# EAGLE design 外形 (EAGLE 9.6.2)
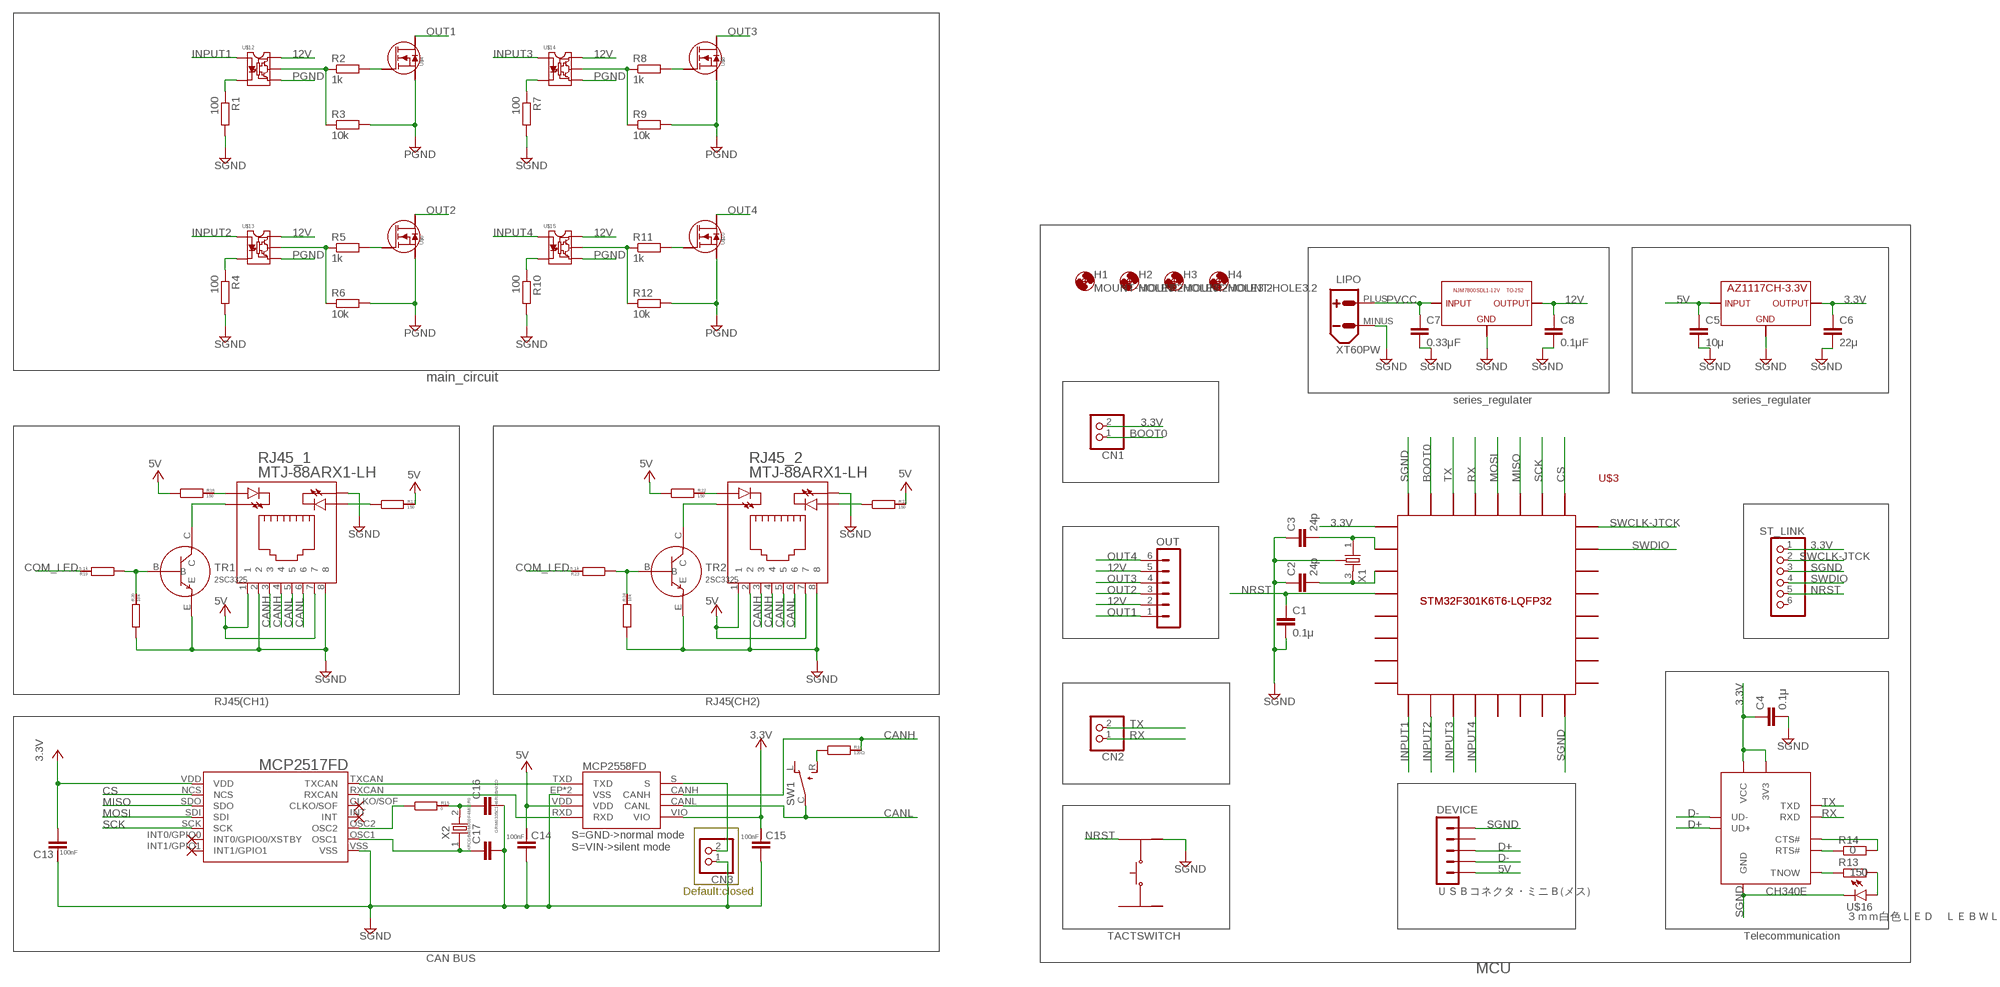
[diagram p0: schematic, sheet 1]

## Parts
C1  0.1μ  GRM0335C1E240GA01D  [GRM0335C1E240GA01D]
C2  24p  GRM0335C1E240GA01D  [GRM0335C1E240GA01D]
C3  24p  GRM0335C1E240GA01D  [GRM0335C1E240GA01D]
C4  0.1μ  GRM0335C1E240GA01D  [GRM0335C1E240GA01D]
C5  10μ  GRM0335C1E240GA01D  [GRM0335C1E240GA01D]
C6  22μ  GRM0335C1E240GA01D  [GRM0335C1E240GA01D]
C7  0.33μF  GRM0335C1E240GA01D  [GRM0335C1E240GA01D]
C8  0.1μF  GRM0335C1E240GA01D  [GRM0335C1E240GA01D]
C13  GCM188L81H104KA57  [GCM188L81H104KA57]
C14  GCM188L81H104KA57  [GCM188L81H104KA57]
C15  GCM188L81H104KA57  [GCM188L81H104KA57]
C16  GRM0335C1H6R0BA01D  [GRM0335C1H120GA01]
C17  GRM0335C1H6R0BA01D  [GRM0335C1H120GA01]
CN1  PINHD-1X2  [1X02]
CN2  PINHD-1X2  [1X02]
CN3  PINHD-1X2  [1X02]
DEVICE  ＵＳＢコネクタ・ミニＢ(メス)  [ＵＳＢコネクタ・ミニＢ(メス)]
H1  MOUNT-HOLE3.2  [3,2]
H2  MOUNT-HOLE3.2  [3,2]
H3  MOUNT-HOLE3.2  [3,2]
H4  MOUNT-HOLE3.2  [3,2]
LIPO  XT60PW  [XT60PW]
OUT  06-JST  [B6B-XH]
R1  100  R-EU_M1206  [M1206]
R2  1k  R-EU_M1206  [M1206]
R3  10k  R-EU_M1206  [M1206]
R4  100  R-EU_M1206  [M1206]
R5  1k  R-EU_M1206  [M1206]
R6  10k  R-EU_M1206  [M1206]
R7  100  R-EU_M1206  [M1206]
R8  1k  R-EU_M1206  [M1206]
R9  10k  R-EU_M1206  [M1206]
R10  100  R-EU_M1206  [M1206]
R11  1k  R-EU_M1206  [M1206]
R12  10k  R-EU_M1206  [M1206]
R13  150  R-EU_M1206  [M1206]
R14  0  R-EU_M1206  [M1206]
R15  0  CR0603  [CR0603]
R16  120Ω  CR0603  [CR0603]
R17  150  CR0603  [CR0603]
R18  150  CR0603  [CR0603]
R19  5.1k  CR0603  [CR0603]
R20  10k  CR0603  [CR0603]
R21  150  CR0603  [CR0603]
R22  150  CR0603  [CR0603]
R23  5.1k  CR0603  [CR0603]
R24  10k  CR0603  [CR0603]
REGYURETA  ３．３V  ＡＺ１１１７ＣＨ－３．３ＴＲＧ１  [ＡＺ１１１７ＣＨ－３．３ＴＲＧ１]
RJ45_1  MTJ-88ARX1-LH  [MTJ-88ARX1-LH]
RJ45_2  MTJ-88ARX1-LH  [MTJ-88ARX1-LH]
ST_LINK  PINHD-1X6  [1X06]
SW1  SS-12SDP2  [SS-12SDP2]
TR1  2SC3325  [2SC3325]
TR2  2SC3325  [2SC3325]
U1  CH340E  [MSOP-10]
U2  MCP2517FD  [MCP2517FD]
U$1  MCP2558FD  [MCP2558FD]
U$3  STM32K6T6-LQFP32  [STM32F301K6T6-LQFP32]
U$4  PXN012-60QL  [PXN012-60QL]
U$5  TACTSWITCH  [TACTSWITCH]
U$6  PXN012-60QL  [PXN012-60QL]
U$8  PXN012-60QL  [PXN012-60QL]
U$10  PXN012-60QL  [PXN012-60QL]
U$12  TLP155E  [TLP155E]
U$13  TLP155E  [TLP155E]
U$14  TLP155E  [TLP155E]
U$15  TLP155E  [TLP155E]
U$16  ３ｍｍ白色ＬＥＤ ＬＥＢＷＬ３４Ａ０６ＡＡ００  [LED5MM]
U$17  NJM7800SDL1-12V  [NJM7800SDL1-12V]
X1  RH100-24.000-18-1020-EXT-TR  [RH100-24.000-18-1020-EXT-TR]
X2  XRCGB40M000F4M01R0  [XRCGB40M000F4M00R0]

## Nets
3.3V: C4.1 C6.1 C13.P$2 C15.P$1 CN1.2 REGYURETA.OUTPUT REGYURETA.VOUT(OUTPUT) ST_LINK.1 U1.3V3 U1.VCC U2.VDD U$1.VIO U$3.VDD1 ; supply symbol labelled +3V3
5V: C5.1 C14.P$1 DEVICE.VBUS R17.RIGHT R18.LEFT R21.RIGHT R22.LEFT REGYURETA.INPUT RJ45_1.1 RJ45_1.7 RJ45_2.1 RJ45_2.7 U$1.VDD ; supply symbol labelled +5V
12V: C8.1 OUT.2 OUT.5 U$12.VCC U$13.VCC U$14.VCC U$15.VCC U$17.VOUT(OUTPUT)
BOOT0: CN1.1 U$3.BOOT0
CANH: R16.RIGHT RJ45_1.3 RJ45_1.4 RJ45_2.3 RJ45_2.4 U$1.CANH
CANL: RJ45_1.5 RJ45_1.6 RJ45_2.5 RJ45_2.6 SW1.C U$1.CANL
COM_LED: R19.RIGHT R23.RIGHT
CS: U2.NCS U$3.PA15
D+: DEVICE.D+ U1.UD+
D-: DEVICE.D- U1.UD-
INPUT1: U$3.PA3 U$12.ANODE
INPUT2: U$3.PA4 U$13.ANODE
INPUT3: U$3.PA5 U$14.ANODE
INPUT4: U$3.PA6 U$15.ANODE
MISO: U2.SDO U$3.PB4(PB3)
MOSI: U2.SDI U$3.PB5(PB4)
N$1: R2.2 U$4.GATE
N$3: R5.2 U$6.GATE
N$4: R13.2 U$16.A
N$5: R13.1 U1.TNOW
N$6: R1.1 U$12.CATHODE
N$9: R4.1 U$13.CATHODE
N$10: R14.1 U1.RTS#
N$11: R14.2 U1.CTS#
N$12: C2.2 U$3.PF1/OSC_OUT X1.3
N$14: R7.1 U$14.CATHODE
N$15: R8.2 U$8.GATE
N$16: R11.2 U$10.GATE
N$19: R10.1 U$15.CATHODE
N$20: C3.2 U$3.PF0/OSC_IN X1.1
N$23: R16.LEFT SW1.R
N$27: U2.TXCAN U$1.TXD
N$28: U2.RXCAN U$1.RXD
N$38: R15.LEFT U2.OSC2
N$39: C17.1 U2.OSC1 X2.1
N$42: C16.1 R15.RIGHT X2.2
N$51: R17.LEFT RJ45_1.LED2_A
N$53: R21.LEFT RJ45_2.LED2_A
N$68: CN3.2 U$1.S
N$69: R18.RIGHT RJ45_1.LED1_A
N$70: R22.RIGHT RJ45_2.LED1_A
N$71: RJ45_1.LED1_K TR1.C
N$72: RJ45_2.LED1_K TR2.C
N$73: R23.LEFT R24.RIGHT TR2.B
N$74: R19.LEFT R20.RIGHT TR1.B
NRST: C1.1 ST_LINK.5 U$3.NRST U$5.P$1
OUT1: OUT.1 U$4.DRAIN1(DRAIN) U$4.DRAIN2(DRAIN) U$4.DRAIN3(DRAIN) U$4.DRAIN4(DRAIN)
OUT2: OUT.3 U$6.DRAIN1(DRAIN) U$6.DRAIN2(DRAIN) U$6.DRAIN3(DRAIN) U$6.DRAIN4(DRAIN)
OUT3: OUT.4 U$8.DRAIN1(DRAIN) U$8.DRAIN2(DRAIN) U$8.DRAIN3(DRAIN) U$8.DRAIN4(DRAIN)
OUT4: OUT.6 U$10.DRAIN1(DRAIN) U$10.DRAIN2(DRAIN) U$10.DRAIN3(DRAIN) U$10.DRAIN4(DRAIN)
PGND: R3.2 R6.2 R9.2 R12.2 U$4.SOURCE1(SOURCE) U$4.SOURCE2(SOURCE) U$4.SOURCE3(SOURCE) U$6.SOURCE1(SOURCE) U$6.SOURCE2(SOURCE) U$6.SOURCE3(SOURCE) U$8.SOURCE1(SOURCE) U$8.SOURCE2(SOURCE) U$8.SOURCE3(SOURCE) U$10.SOURCE1(SOURCE) U$10.SOURCE2(SOURCE) U$10.SOURCE3(SOURCE) U$12.GND U$13.GND U$14.GND U$15.GND ; supply symbol labelled GND
PVCC: C7.1 LIPO.PLUS(+) U$17.VIN(INPUT)
RX: CN2.1 U1.RXD U$3.PB6(PB5)
SCK: U2.SCK U$3.PB3(PB2)
SGND: C1.2 C2.1 C3.1 C4.2 C5.2 C6.2 C7.2 C8.2 C13.P$1 C14.P$2 C15.P$2 C16.2 C17.2 CN3.1 DEVICE.GND LIPO.MINUS(-) R1.2 R4.2 R7.2 R10.2 R20.LEFT R24.LEFT REGYURETA.ADJ/GND(GND) RJ45_1.2 RJ45_1.8 RJ45_1.LED2_K RJ45_2.2 RJ45_2.8 RJ45_2.LED2_K ST_LINK.3 TR1.E TR2.E U1.GND U2.VSS U$1.EP(VSS) U$1.VSS U$3.VSS1 U$3.VSS2 U$5.P$3 U$16.K(C) U$17.GND X1.2(SHIELD) X1.4(SHIELD) ; supply symbol labelled GND
SWCLK-JTCK: ST_LINK.2 U$3.PA14
SWDIO: ST_LINK.4 U$3.PA13
TX: CN2.2 U1.TXD U$3.PB7(PB6)
V1: R2.1 R3.1 U$12.VOUT
V2: R5.1 R6.1 U$13.VOUT
V3: R8.1 R9.1 U$14.VOUT
V4: R11.1 R12.1 U$15.VOUT
Unconnected: DEVICE.ID ST_LINK.6 SW1.L U2.CLKO/SOF U2.INT U2.INT0/GPIO0(INT0/GPIO0/XSTBY) U2.INT1/GPIO1 U$3.PA0 U$3.PA1 U$3.PA2 U$3.PA7 U$3.PA8 U$3.PA9 U$3.PA10 U$3.PA11 U$3.PA12 U$3.PB0 U$3.PB1 U$3.VDD2 U$3.VDDA/VREF+ U$5.P$2 U$5.P$4

## Notes on the sheet
- main_circuit
- series_regulater | series_regulater
- RJ45(CH1) | RJ45(CH2)
- S=GND->normal mode
  S=VIN->silent mode
- Default:closed
- TACTSWITCH | Telecommunication
- CAN BUS
- MCU

## Library data of the parts
C1-C8 = GRM0335C1E240GA01D:GRM0335C1E240GA01D
C13-C15 = GCM188L81H104K57(0.1uF):GCM188L81H104KA57
C16 C17 = GRM0335C1H6R0BA01D:GRM0335C1H6R0BA01D
CN1-CN3 = pinhead:PINHD-1X2: PIN HEADER
DEVICE = ＵＳＢコネクタ・ミニＢ(メス):ＵＳＢコネクタ・ミニＢ(メス)
H1-H4 = holes:MOUNT-HOLE: MOUNTING HOLE with drill center marker
LIPO = xt60pw:XT60PW
OUT = con-jst-xh (1):06-JST: JST CONNECTOR
R1-R14 = rcl:R-EU_: RESISTOR, European symbol; SPICEPREFIX: R
R15-R24 = CR0603:CR0603
REGYURETA = AZ1117CH-3.3TRG1:ＡＺ１１１７ＣＨ－３．３ＴＲＧ１
RJ45_1 RJ45_2 = MTJ-88ARX1-LH:MTJ-88ARX1-LH
ST_LINK = pinhead:PINHD-1X6: PIN HEADER
SW1 = SS-12SDP2:SS-12SDP2
TR1 TR2 = 2SC3325:2SC3325
U1 = CH340E:CH340E
U2 = MCP2517FD:MCP2517FD
U$1 = MCP2558FD:MCP2558FD
U$3 = STM32F301K6T6-LQFP32:STM32K6T6-LQFP32
U$4 U$6 U$8 U$10 = mosfet PXN012-60QL:PXN012-60QL
U$5 = TACTSWITCH (CS11027.0F100):TACTSWITCH
U$12-U$15 = TLP155E(TPL, E)):TLP155E
U$16 = LED３ｍｍ白色　ＬＥＢＷＬ３４Ａ０６ＡＡ００:３ｍｍ白色ＬＥＤ　ＬＥＢＷＬ３４Ａ０６ＡＡ００
U$17 = TO-250 NJM7800SDL1-12V:NJM7800SDL1-12V
X1 = RH100-24.000-18-1020-EXT-TR:RH100-24.000-18-1020-EXT-TR
X2 = XRCGB40M000F4M01R0:XRCGB40M000F4M01R0

## Board
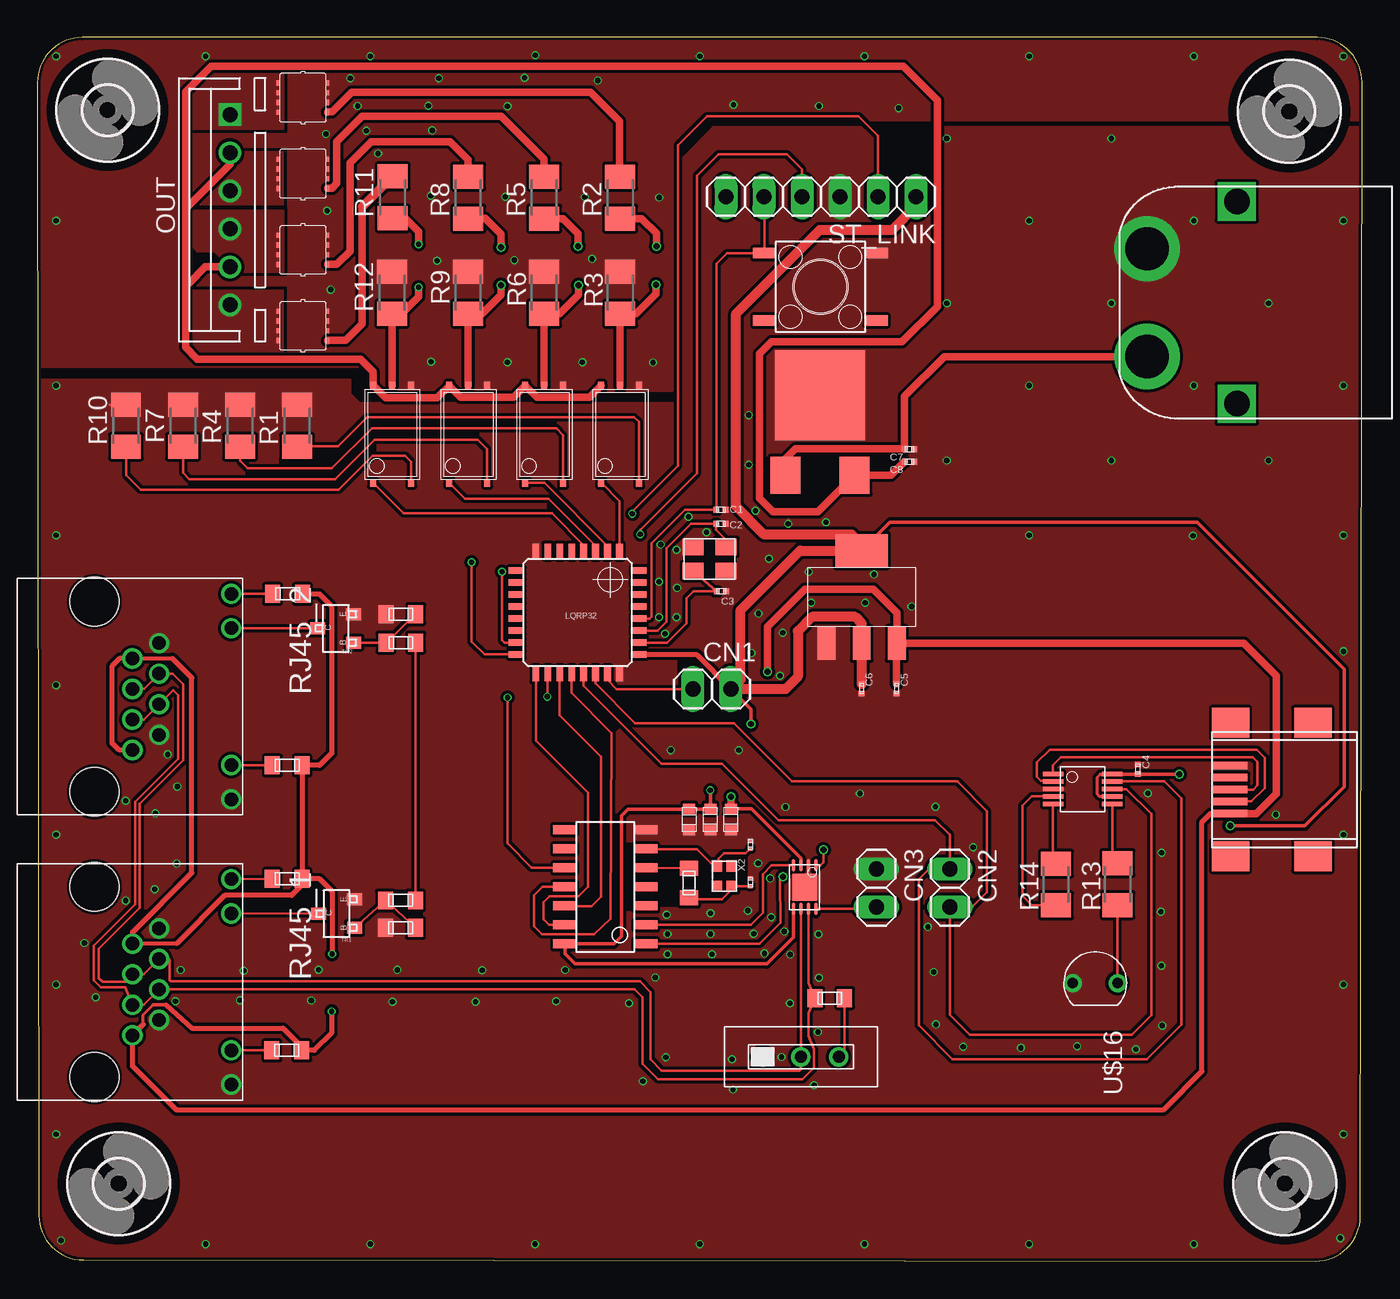
[diagram p1: board, top side]
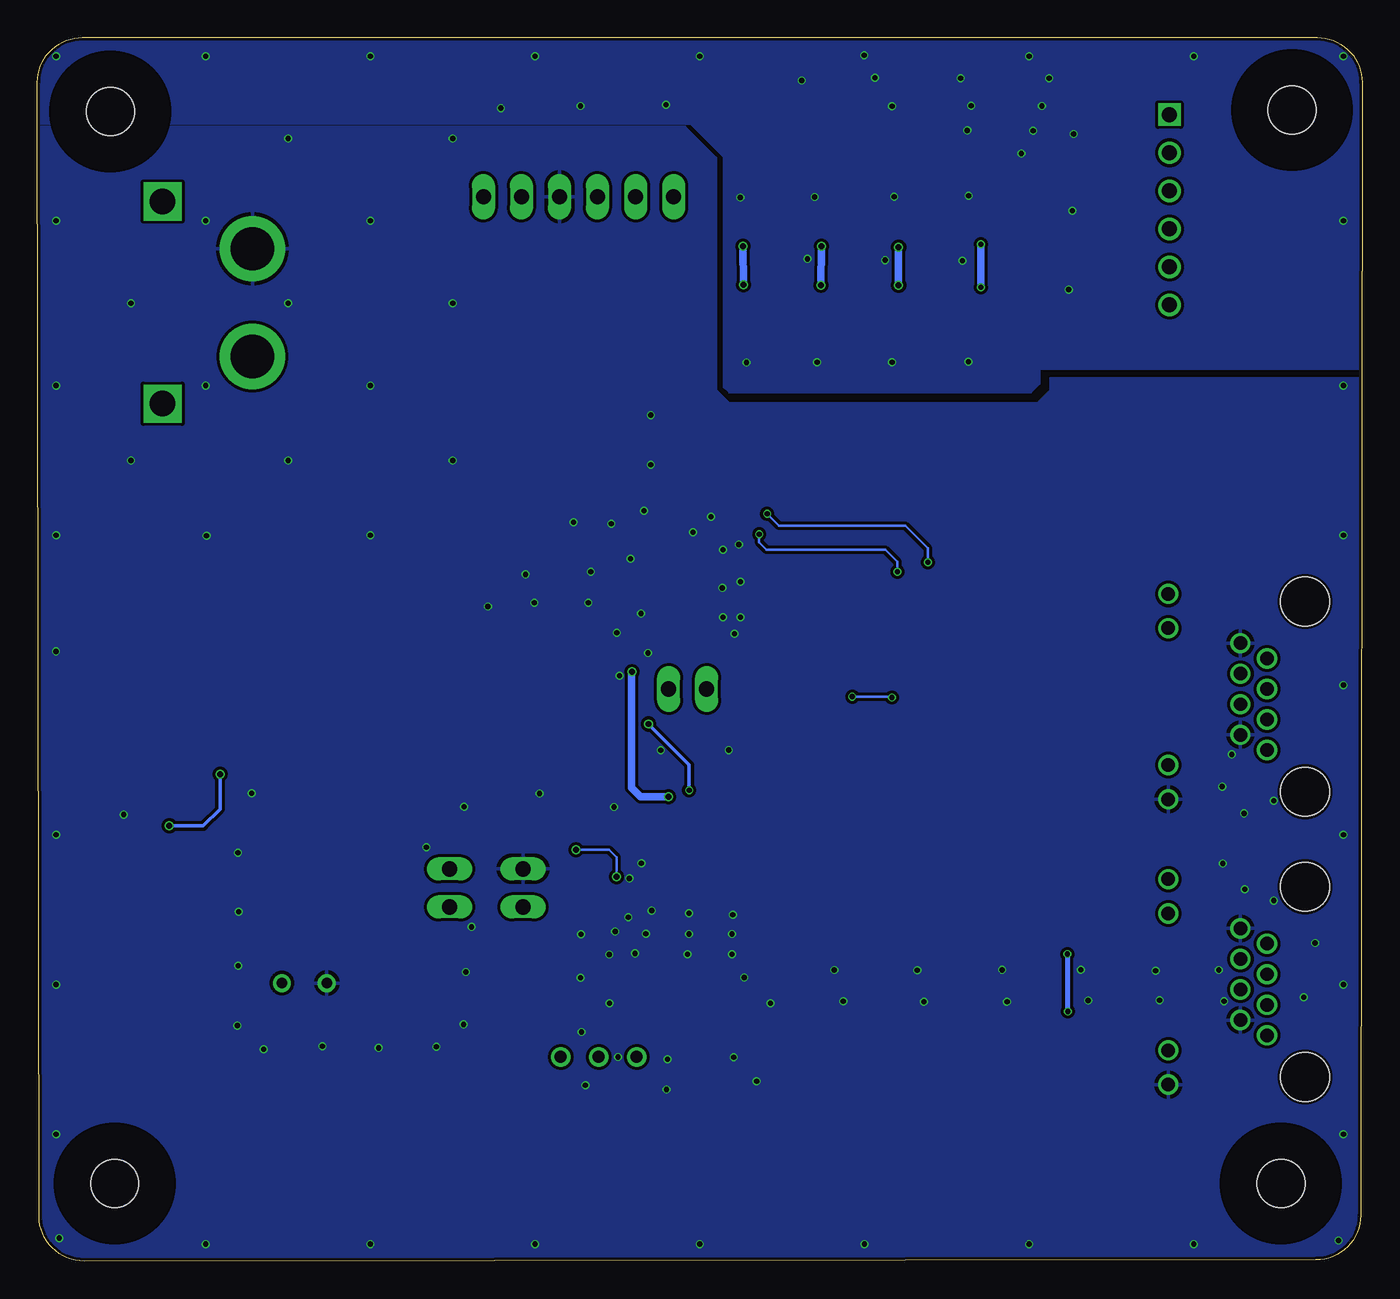
[diagram p2: board, bottom side, seen from below]

Size 88.49 x 81.72 mm. Coordinates in mm from the lower left corner, seen from the top.
Outline: 0,78.71 0.09,3.07 arc90 3.09,0.07 85.38,0 arc90 88.38,3 88.49,78.71 arc90 85.49,81.72 3,81.72 arc90 0,78.71
Copper layers (1*16): Top 0.035559375mm / dielectric 1.6mm / Bottom 0.035559375mm
Design rules "jlcpcb2layer *": minimum track width 5mil, minimum drill 12mil, track to track 8mil, track to pad 8mil, pad to pad 5mil, via to via 5mil, smd to smd 5mil, copper to edge 8mil, drill to drill 6mil, minimum pad ring 5mil, minimum via ring 3mil, stop-mask expansion 2.5mil, vias tented up to drill 0mil, thermal gap 10mil

### Footprints (pad centres in the part's own frame; a part is rotated, then mirrored left to right if it is on the bottom)
GRM0335C1E240GA01D = smd 0.35 x 0.4: 1 -0.325,0; 2 0.325,0
GCM188L81H104KA57 = smd 0.7 x 0.8: P$1 -0.7,0; P$2 0.7,0
GRM0335C1H120GA01 = smd 0.25 x 0.3: 1 -0.275,0; 2 0.275,0
1X02 = drill 1.016 long: 1 -1.27,0; 2 1.27,0
ＵＳＢコネクタ・ミニＢ(メス) = smd 0.5 x 2.3: D+ 0,2.77; D- -0.8,2.77; GND 1.6,2.77; ID 0.8,2.77; VBUS -1.6,2.77 | smd 2 x 2.5: P$6 -4.45,2.75; P$7 -4.45,-2.75; P$8 4.45,2.75; P$9 4.45,-2.75
3,2 = hole 3.2: 0,0
XT60PW = drill 2.9 pad 4.35: MINUS -3.6,0; PLUS 3.6,0 | drill 1.7 square: P$1 -6.75,6; P$2 6.75,6
B6B-XH = drill 1 square: 1 6.35,0 | drill 1: 2 3.81,0; 3 1.27,0; 4 -1.27,0; 5 -3.81,0; 6 -6.35,0
M1206 = smd 1.6 x 2: 1 -1.4,0; 2 1.4,0
CR0603 = smd 1 x 1.2: LEFT -1,0; RIGHT 1,0
ＡＺ１１１７ＣＨ－３．３ＴＲＧ１ = smd 1.2 x 2.2: ADJ/GND -2.35,-3.1; INPUT 2.35,-3.1; OUTPUT 0,-3.1 | smd 3.5 x 2.2: VOUT 0,3.1
MTJ-88ARX1-LH = drill 0.9: 1 9.92,2.54; 2 8.9,4.32; 3 7.88,2.54; 4 6.86,4.32; 5 5.84,2.54; 6 4.82,4.32; 7 3.8,2.54; 8 2.78,4.32; LED1_A -0.51,9.14; LED1_K 1.78,9.14; LED2_A 10.92,9.14; LED2_K 13.21,9.14 | hole 3.25: 0,0; 12.7,0
1X06 = drill 1.016 long: 1 -6.35,0; 2 -3.81,0; 3 -1.27,0; 4 1.27,0; 5 3.81,0; 6 6.35,0
SS-12SDP2 = drill 0.8 pad 1.3: C 0,0; L -2.54,0; R 2.54,0
2SC3325 = smd 1 x 0.8: B 0,1.9; C 2.4,0.95; E 0,0
MSOP-10 = smd 0.3 x 1.35: 3V3 -1,1.975; CTS# 1,-1.975; GND 0,-1.975; RTS# 0.5,-1.975; RXD -0.5,1.975; TNOW 1,1.975; TXD 0,1.975; UD+ -1,-1.975; UD- -0.5,-1.975; VCC 0.5,1.975
MCP2517FD = smd 0.6 x 1.55: CLKO/SOF 2.54,0; INT 3.81,0; INT0/GPIO0 6.35,5.4; INT1/GPIO1 7.62,5.4; NCS 1.27,5.4; OSC1 6.35,0; OSC2 5.08,0; RXCAN 1.27,0; SCK 5.08,5.4; SDI 3.81,5.4; SDO 2.54,5.4; TXCAN 0,0; VDD 0,5.4; VSS 7.62,0
MCP2558FD = smd 0.25 x 0.85: CANH -0.25,1.45; CANL 0.25,1.45; RXD 0.75,-1.45; S -0.75,1.45; TXD -0.75,-1.45; VDD 0.25,-1.45; VIO 0.75,1.45; VSS -0.25,-1.45 | smd 1.65 x 1.8: EP 0,0
STM32F301K6T6-LQFP32 = smd 0.45 x 1: BOOT0 -2,4.1; PA3 -2.8,-4.1; PA4 -2,-4.1; PA5 -1.2,-4.1; PA6 -0.4,-4.1; PA7 0.4,-4.1; PA15 2.8,4.1; PB0 1.2,-4.1; PB1 2,-4.1; PB3 2,4.1; PB4 1.2,4.1; PB5 0.4,4.1; PB6 -0.4,4.1; PB7 -1.2,4.1; VSS1 2.8,-4.1; VSS2 -2.8,4.1 | smd 1 x 0.45: NRST -4.1,0.4; PA0 -4.1,-1.2; PA1 -4.1,-2; PA2 -4.1,-2.8; PA8 4.1,-2; PA9 4.1,-1.2; PA10 4.1,-0.4; PA11 4.1,0.4; PA12 4.1,1.2; PA13 4.1,2; PA14 4.1,2.8; PF0/OSC_IN -4.1,2; PF1/OSC_OUT -4.1,1.2; VDD1 -4.1,2.8; VDD2 4.1,-2.8; VDDA/VREF+ -4.1,-0.4
PXN012-60QL = smd 0.35 x 0.2: DRAIN1 -0.975,-1.65; DRAIN2 -0.325,-1.65; DRAIN3 0.325,-1.65; DRAIN4 0.975,-1.65; GATE 0.975,1.65; SOURCE1 -0.975,1.65; SOURCE2 -0.325,1.65; SOURCE3 0.325,1.65
TACTSWITCH = smd 1.5 x 0.7: P$1 -3.75,2.25; P$2 -3.75,-2.25; P$3 3.75,2.25; P$4 3.75,-2.25
TLP155E = smd 0.4 x 0.5: ANODE -1.27,0; CATHODE 1.27,0; GND 1.27,6.5; VCC -1.27,6.5; VOUT 0,6.5
LED5MM = drill 0.7 pad 1.2: A 0,1.5; K 0,-1.5
NJM7800SDL1-12V = smd 6 x 6: GND 0,3 | smd 2 x 2.5: VIN -2.3,-2.35; VOUT 2.3,-2.35
RH100-24.000-18-1020-EXT-TR = smd 1.4 x 1.1: 1 -1.1,-0.8; 2 1.1,-0.8; 3 1.1,0.8; 4 -1.1,0.8
XRCGB40M000F4M00R0 = smd 0.75 x 0.7: 1 -0.675,-0.5; 2 0.675,0.5; NC1 -0.675,0.5; NC2 0.675,-0.5

### Placement (x,y rotation side)
C1  45.67,50.17 0 top
C2  45.67,49.23 180 top
C3  45.69,44.73 180 top
C4  73.5,32.85 90 top
C5  57.4,38.23 270 top
C6  55.06,38.23 270 top
C7  58.25,54.22 0 top
C8  58.25,53.38 0 top
C13  43.53,29.49 90 top
C14  46.33,29.49 270 top
C15  44.95,29.49 270 top
C16  47.62,25.3 90 top
C17  47.62,27.82 90 top
CN1  45.06,38.21 0 top
CN2  60.96,24.92 270 top
CN3  56.05,24.92 270 top
DEVICE  82.46,31.5 90 top
H1  4.69,76.87 0 top
H2  83.63,76.78 0 top
H3  83.33,5.18 0 top
H4  5.43,5.18 0 top
LIPO  74.13,64.01 270 top
OUT  12.86,70.21 90 top
R1  17.34,55.78 90 top
R2  38.93,71.02 90 top
R3  38.93,64.67 90 top
R4  13.53,55.78 90 top
R5  33.85,71.02 90 top
R6  33.85,64.67 90 top
R7  9.72,55.78 90 top
R8  28.77,71.02 90 top
R9  28.77,64.67 90 top
R10  5.91,55.78 90 top
R11  23.73,71.04 90 top
R12  23.69,64.67 90 top
R13  72.16,25.18 270 top
R14  68.04,25.15 90 top
R15  43.53,25.25 270 top
R16  52.93,17.57 180 top
R17  16.66,14.08 0 top
R18  16.68,25.53 180 top
R19  24.25,24.08 0 top
R20  24.25,22.25 0 top
R21  16.68,33.1 0 top
R22  16.71,44.56 180 top
R23  24.28,41.3 0 top
R24  24.28,43.21 0 top
REGYURETA  55.06,44.35 0 top
RJ45_1  3.81,25 270 top
RJ45_2  3.81,44.05 270 top
ST_LINK  52.35,71.07 180 top
SW1  51,13.64 0 top
TR1  21.18,24.16 180 top
TR2  21.13,43.21 180 top
U1  69.82,31.53 270 top
U2  40.64,21.19 90 top
U$1  51.25,24.97 180 top
U$3  36.09,43.31 180 top
U$4  17.74,77.69 270 top
U$5  52.31,65.06 0 top
U$6  17.74,72.61 270 top
U$8  17.74,67.53 270 top
U$10  17.74,62.45 270 top
U$12  38.93,51.97 0 top
U$13  33.85,51.97 0 top
U$14  28.77,51.97 0 top
U$15  23.69,51.97 0 top
U$16  70.66,18.57 270 top
U$17  52.28,54.83 0 top
X1  44.9,46.89 0 top
X2  45.89,25.71 270 top

### Tracks (layer width: path | path; a pad name or v marks a point on that pad's centre or on a via)
3.3V  (via drill 0.35, 0.4 pad 0.55)
  Top 0.152: U$3.VDD1 40.24,40.46 40.32,40.54 | C15.P$1 44.97,30.19 | U2.VDD | 43.51,30.17 C13.P$2 | 55.06,47.36 REGYURETA.VOUT | CN1.2 46.4,38.13 | U1.3V3 | v44.95,31.45 | v76.29,32.52
  Top 0.2: U1.VCC 70.96,31.03 70.8,31.18 70.8,32.31 71.01,32.51 71.78,32.51 U1.3V3
  Top 0.25: U2.VDD 38.52,21.19 39.03,21.7 39.03,29.73 39.47,30.17 43.51,30.17 44.94,30.17 | U$1.VIO 50.5,21.63 48.72,19.85 35.9,19.85 35.24,20.52 U2.VDD | v76.29,32.52 C4.1 U1.3V3 | v79.67,29.06 84.67,29.06 87.3,31.69 87.3,39.51 77.49,49.33 56.94,49.33 REGYURETA.VOUT | CN1.2 47.67,36.86 v47.67,35.87 | C15.P$1 v44.95,31.45
  Top 0.35: U$3.VDD1 44.02,40.51 CN1.2
  Top 0.675: C6.1 REGYURETA.OUTPUT 55.06,42.59 54.64,43.02 51.75,43.02 50.81,42.08 50.81,39.04 49.97,38.21 CN1.2 46.97,38.85 46.97,43.47 50.95,47.45 54.97,47.45 55.06,47.36 | REGYURETA.VOUT 55.06,47.87 54.41,48.52 48.55,48.52 46.67,50.4 46.67,63.27 52.25,68.85 57.07,68.85 58.7,70.48 ST_LINK.1 | C15.P$1 44.94,30.17
  Bottom 0.152: v47.67,35.87 47.67,35.85
  Bottom 0.25: 47.67,35.85 44.95,33.13 v44.95,31.45 | v79.67,29.06 77.42,29.06 76.29,30.19 v76.29,32.52
5V  (via drill 0.35, 0.4 pad 0.55)
  Top 0.152: U$1.VDD | 46.35,30.21 C14.P$1 | RJ45_1.7 | v19.69,20.51 19.67,20.53
  Top 0.2: 7.74,17.12 7.07,16.45 7.07,15.8
  Top 0.25: 7.74,17.12 8.59,17.12 | U$1.VDD 51,26.91 47.71,30.19 C14.P$1
  Top 0.28: 9.29,21.2 RJ45_1.7 | RJ45_2.7 9.01,40.25
  Top 0.35: R18.LEFT 18.85,25.53 19.67,24.71 19.67,20.53 | R18.LEFT R21.RIGHT 18.85,33.1 19.66,33.91 19.66,43.72 18.82,44.56 R22.LEFT | 7.07,15.8 RJ45_1.1 6.35,13.04 9.29,10.09 75.2,10.09 77.8,12.68 77.8,29.32 78.37,29.9 DEVICE.VBUS | 8.59,17.12 10.33,15.56 16.4,15.56 17.66,14.31 R17.RIGHT 18.5,14.08 19.65,15.23 v19.65,16.67 | RJ45_1.7 6.36,21.97 10.32,25.93 10.32,38.96 9.02,40.26 9.01,40.25 | R18.LEFT 17.68,25.13 16.98,24.43 12.52,24.43 9.29,21.2 | RJ45_2.7 5.5,40.25 4.98,39.72 4.98,34.62 5.47,34.13 RJ45_2.1
  Top 0.5: v46.35,31 46.35,30.21 | v48.76,39.35 48.76,42.36 51.27,44.86 55.85,44.86 57.41,43.3 REGYURETA.INPUT | REGYURETA.INPUT 80.59,41.25 82.75,39.1 82.75,31.21 81.42,29.89 DEVICE.VBUS | REGYURETA.INPUT 57.39,41.23 C5.1
  Bottom 0.152: v48.76,39.35 48.8,39.31 | v19.69,20.51 19.67,20.49 | 19.67,16.73 19.65,16.71 v19.65,16.67
  Bottom 0.35: 19.67,20.49 19.67,16.73
  Bottom 0.5: 48.8,39.31 48.8,31.6 48.2,31 v46.35,31
12V
  Top 0.152: 32.58,58.43 U$13.VCC | 27.52,58.47 U$14.VCC | U$15.VCC
  Top 0.3: U$17.VOUT | U$15.VCC 22.46,58.47 | U$14.VCC 27.5,58.45 | U$13.VCC
  Top 0.5: 9.9,70.28 9.9,65.32 | 9.9,65.32 9.9,61.02 10.68,60.24 21.59,60.24 22.42,59.4 U$15.VCC | 9.9,65.32 10.13,65.32 11.22,66.4 OUT.5 | OUT.2 12.86,73.25 9.9,70.28 | 9.9,70.28 9.9,78.08 11.61,79.78 57.86,79.78 60.11,77.53 60.11,63.74 57.76,61.4 49.04,61.4 48.23,60.58 48.23,50.95 49.14,50.04 52.14,50.04 U$17.VOUT 57.03,52.48 C8.1 | 22.46,58.47 23.27,57.67 26.71,57.67 27.52,58.47 | 27.5,58.45 28.26,57.7 31.81,57.7 U$13.VCC | U$13.VCC 33.38,57.69 36.88,57.69 U$12.VCC
BOOT0
  Top 0.152: U$3.BOOT0 38.08,38.81 38.69,38.2 CN1.1
CANH
  Top 0.152: RJ45_2.3 7.11,36.17 RJ45_2.4 9.07,38.13 9.42,37.78 9.42,33.56 6.52,30.66 6.52,23.82 3.77,21.07 3.77,18.76 4.23,18.29 5.86,18.29 RJ45_1.3 7.11,17.12 RJ45_1.4 39.89,18.14 40.41,17.62 40.41,13.19 41.45,12.15 51.1,12.15 51.89,12.93 51.89,14.15 51.51,15.06 51.51,16.55 R16.RIGHT 51.5,18.59 U$1.CANH
CANL
  Top 0.152: RJ45_2.5 7.13,38.21 8.13,39.2 RJ45_2.6 9.04,39.23 9.75,38.52 9.75,33.46 6.83,30.53 6.83,23.59 4.09,20.85 4.09,18.9 4.35,18.64 6.28,18.64 6.35,18.71 RJ45_1.5 7.11,19.16 RJ45_1.6 8.77,20.18 8.84,20.11 8.84,18.75 8.91,18.67 40.26,18.67 40.97,17.97 40.97,13.47 41.7,12.73 50.91,12.73 51,12.82 SW1.C U$1.CANL
COM_LED
  Top 0.152: R23.RIGHT R19.RIGHT
CS
  Top 0.152: U2.NCS 34.19,22.46 33.83,22.82 33.83,23.97 34.21,24.36 36.14,24.36 36.77,24.99 36.77,31.28 33.32,34.74 33.32,39.19 U$3.PA15
D+
  Top 0.152: DEVICE.D+ 81.21,31.49 81.49,31.77 81.49,33.36 81.19,33.66 68.37,33.66 67.85,33.13 U1.UD+
D-
  Top 0.152: U1.UD- 67.78,32.1 67.04,32.1 66.78,32.35 66.78,33.31 67.63,34.15 81.46,34.15 82,33.62 82,31.59 81.1,30.7 DEVICE.D-
INPUT1
  Top 0.152: U$3.PA3 38.89,50.76 U$12.ANODE
INPUT2
  Top 0.152: U$13.ANODE 33.87,51.97 38.13,47.71 38.13,47.45 U$3.PA4
INPUT3
  Top 0.152: U$3.PA5 37.29,47.78 34.16,50.91 28.57,50.91 U$14.ANODE
INPUT4
  Top 0.152: U$3.PA6 36.56,47.49 36.56,47.75 34.37,49.94 24.45,49.94 U$15.ANODE
MISO
  Top 0.152: U2.SDO 35.26,23.71 37,23.71 37.64,24.34 37.64,33.7 34.89,36.44 U$3.PB4
MOSI
  Top 0.152: U2.SDI 33.74,25 33.17,24.43 33.17,22.37 33.72,21.81 37.2,21.81 38.27,22.88 38.36,35.27 35.69,37.94 U$3.PB5
N$1
  Top 0.5: 38.88,72.48 38.88,76.13 36.96,78.05 20.99,78.05 19.68,76.74 19.42,76.74 U$4.GATE
  Top 0.6: R2.2 38.88,72.48
N$3
  Top 0.5: R5.2 33.85,73.59 30.99,76.46 21.69,76.46 20,74.77 20,71.97 19.68,71.66 19.42,71.66 U$6.GATE
N$4
  Top 0.152: R13.2 U$16.A
N$5
  Top 0.152: R13.1 71.8,26.94 U1.TNOW
N$6
  Top 0.152: U$12.CATHODE 40.18,51.99 40.18,56.04 39.87,56.36 22.03,56.36 20.08,54.41 17.37,54.41 R1.1
N$9
  Top 0.152: U$13.CATHODE 35.12,55.16 34.67,55.61 22.35,55.61 19.67,52.93 14.05,52.93 13.53,53.44 R4.1
N$10
  Top 0.152: U1.RTS# 66.43,31.03 65.8,30.4 65.8,24.38 66.43,23.75 R14.1
N$11
  Top 0.152: R14.2 67.85,26.75 U1.CTS#
N$12
  Top 0.152: X1.3 46,48.17 45.34,48.83 C2.2 43.66,49.23 42.02,47.59 42.02,42.71 41.41,42.1 40.2,42.1 U$3.PF1/OSC_OUT
N$14
  Top 0.152: U$14.CATHODE 30.04,54.2 29.41,54.84 22.52,54.84 19.9,52.22 10.14,52.22 9.72,52.64 R7.1
N$15
  Top 0.5: R8.2 28.77,73.55 27.56,74.77 22.31,74.77 20.88,73.34 20.88,67.44 19.99,66.56 U$8.GATE
N$16
  Top 0.152: U$10.GATE
  Top 0.5: U$10.GATE 19.42,61.5 20.59,61.5 21.7,62.61 21.7,70.41
  Top 0.6: R11.2 21.7,70.41
N$19
  Top 0.152: U$15.CATHODE 24.96,53.37 24.56,53.77 22.4,53.77 20.12,51.5 6.91,51.5 5.91,52.49 R10.1
N$20
  Top 0.152: X1.1 C3.2 43.82,44.73 43.35,44.27 43.35,42.61 42.06,41.31 U$3.PF0/OSC_IN
N$23
  Top 0.152: R16.LEFT 53.93,14.03 SW1.R
N$27  (via drill 0.4 pad 0.55)
  Top 0.152: U$1.TXD 52.29,26.42 52.5,26.63 v52.5,27.46 | v49.81,25.67 49.59,25.45 49.62,22.59 48.24,21.19 U2.TXCAN
  Bottom 0.152: v52.5,27.46 50.31,27.46 49.81,26.96 v49.81,25.67
N$28
  Top 0.152: U2.RXCAN 47.66,22.46 48.45,23.25 48.45,25.85 49.03,26.42 U$1.RXD
N$38
  Top 0.152: R15.LEFT U2.OSC2
N$39
  Top 0.152: U2.OSC1 40.66,27.51 44.07,27.51 45.2,26.38 X2.1 45.5,26.49 45.5,26.87 45.86,27.23 47.31,27.23 C17.1
N$42
  Top 0.152: R15.RIGHT 43.61,24.18 45.72,24.18 46.35,24.81 46.35,24.99 X2.2 C16.1
N$51
  Top 0.152: R17.LEFT RJ45_1.LED2_A | RJ45_1.LED2_A
N$53
  Top 0.152: R21.LEFT RJ45_2.LED2_A
N$68
  Top 0.152: CN3.2 55.93,23.52 U$1.S
N$69
  Top 0.152: R18.RIGHT RJ45_1.LED1_A
N$70
  Top 0.152: RJ45_2.LED1_A R22.RIGHT
N$71
  Top 0.152: RJ45_1.LED1_K TR1.C
N$72
  Top 0.152: RJ45_2.LED1_K TR2.C
N$73
  Top 0.152: TR2.B R23.LEFT R24.RIGHT
N$74
  Top 0.152: TR1.B R19.LEFT R20.RIGHT
NRST
  Top 0.152: U$3.NRST 40.89,42.91 41.02,43.04 41.02,47.95 43.26,50.19 45.32,50.19 C1.1 45.37,50.2 45.37,66.62 46.07,67.31 U$5.P$1 48.56,71.05 ST_LINK.5
OUT1
  pour Top (no thermals): 16.41,79.44 11.59,79.44 10.23,78.08 10.23,75.61 16.41,75.61
OUT2
  pour Top (no thermals): 16.38,74.04 12.03,74.04 10.23,72.23 10.23,70.59 16.4,70.59 16.4,74.02
OUT3
  pour Top (no thermals): 10.3,70.15 10.3,67.82 10.67,67.45 11.8,67.45 13.18,66.07 16.43,66.07 16.43,70.15
OUT4
  pour Top (no thermals): 10.32,64.81 10.32,61.24 10.87,60.69 16.38,60.69 16.38,64.81
PGND  (via drill 0.35)
  Top 0.152: 35.13,58.48 U$13.GND | 30,58.51 U$14.GND | 24.92,58.51 U$15.GND 24.96,58.53 | U$10.SOURCE3 19.39,62.08 19.35,62.12
  other vias: 1.25,80.47 11.25,80.47 22.25,80.47 33.26,80.53 44.25,80.47 55.25,80.47 66.25,80.47 77.25,80.47 87.25,80.47 1.25,69.47 21.39,77.14 26.12,77.15 31.4,77.12 19.27,75.27 21.98,75.49 26.38,75.51 19.36,70.14 37.44,78.84 22.77,73.97 19.6,64.88 26.71,66.81 31.86,66.85 37.05,66.93 26.29,71.14 31.26,71.08 36.57,71.06 41.54,71.03 26.3,60.07 31.4,60.03 36.41,60.03 41.13,60.01 46.51,77.23 52.22,77.14 57.54,77 32.54,79.02 26.82,79 20.91,78.99
  pour Top (rank 2, no thermals): 21.72,59.73 -0.55,59.73 -1.06,60.43 -1.06,81.48 0.83,83.37 87.75,83.37 90.68,80.44 90.68,76.18 44.85,76.18 42.53,73.86 42.53,58.28 42.39,58.14 22.04,58.14 21.72,58.46
  pour Bottom: 0.49,83.63 -1.36,81.78 -1.36,60.55 -0.41,59.6 21.56,59.6 21.56,58.59 22.14,58.01 42.27,58.01 42.63,58.37 42.63,73.73 44.86,75.96 91.36,75.96 91.36,80.53 87.95,83.94 0.78,83.94 0.36,83.52
PVCC
  Top 0.5: LIPO.PLUS 60.58,60.41 57.93,57.75 C7.1 57.91,54.24 50.64,54.24 49.98,53.58 U$17.VIN
RX
  Top 0.152: U$3.PB6 36.49,38.42 41.69,33.22 45.74,33.22 49.5,29.46 59.96,29.46 60.95,28.47 CN2.1 59.6,26.19 58.89,25.48 58.9,15.75 61.12,13.49 74.13,13.49 76.43,15.8 76.43,30.91 75.29,32.05 71.82,32.05 U1.RXD
SCK  (via drill 0.35)
  Top 0.152: U2.SCK 33.03,26.27 31.39,27.9 31.39,37.62 v31.41,37.64 | U$3.PB3 34.09,37.73 v34.06,37.7
  Bottom 0.152: v34.06,37.7 34.04,37.68 31.45,37.68 v31.41,37.64
SGND  (via drill 0.35)
  Top 0.152: X1.2 46.46,46.09 | U$5.P$3 56.25,67.31 | R10.2 4.84,57.18 | R24.LEFT 23.27,43.22 | 51.5,26.43 U$1.VSS 51.51,25.97 51.25,25.71 U$1.EP | 79.71,33.12 DEVICE.GND | C4.2 73.45,33.16 | U1.GND 67.83,31.55 | REGYURETA.ADJ/GND 52.68,41.22 | C6.2 | 33.42,47.28 U$3.VSS1 33.3,47.4 | U$3.VSS2 38.86,39.24 | C8.2
  other vias: 62.51,27.64 60,30.35 54.95,31.23 49.98,30.33 46.85,34.11 42.31,34.13 9.35,31.69 7.89,29.9 9.3,26.56 7.84,24.84 13.53,17.42 13.79,19.4 18.3,17.41 18.79,19.46 24.05,19.45 23.72,17.33 29.28,17.33 29.72,19.42 34.66,17.35 35.26,19.44 39.52,17.23 41.28,18.94 40.45,12.02 41.98,13.61 51.89,11.74 46.47,11.46 46.41,13.49 49.71,13.63 50.29,20.48 50.27,17.22 52.21,18.93 52.18,21.83 1.25,8.47 11.25,1.14 22.25,1.14 33.25,1.14 44.25,1.14 55.25,1.14 66.25,1.14 77.25,1.14 87.04,1.54 52.15,15.3 55.3,43.97 51.7,43.97 49.79,41.96 49.61,39.1 47.7,40.61 48.18,43.25 48.88,46.91 51.53,46.03 55.89,45.86 58.4,43.72 42.1,21.85 47.85,21.86 49.02,22.96 48.95,25.56 44.96,21.85 48.58,20.55 45.06,20.5 42.09,20.49 49.9,22.01 3.89,17.62 3.14,21.25 5.9,24.08 5.9,30.74 8.7,33.84 9.58,19.44 9.22,17.36 74.18,31.24 75.1,27.28 75.06,23.33 75.08,19.73 75.14,15.73 73.38,14.15 69.46,14.36 65.7,14.24 61.85,14.31 60.02,15.81 59.88,19.31 59.49,22.32 47.46,23.41 44.97,23.23 42.04,23.14 48.15,26.58 1.25,18.47 87.25,28.47 1.25,38.47 1.25,28.47 87.25,18.47 87.26,40.72 41.93,41.89 42.7,43 42.74,44.96 41.53,43 41.53,45.37 44.7,48.67 42.69,47.51 41.64,47.86 43.5,49.72 1.25,58.47 1.25,48.47 47.98,50.12 47.52,53.18 47.52,56.5 50.16,49.25 52.68,49.35 60.75,53.47 66.25,48.47 71.75,53.47 77.2,48.45 82.25,53.47 87.25,48.47 87.25,58.47 77.25,58.47 66.25,58.47 60.75,63.97 71.75,63.97 82.25,63.97 87.25,69.47 77.25,69.47 66.25,69.47 60.75,74.97 71.75,74.97 82.73,29.82 1.58,1.38 87.25,8.47
  pour Top (no thermals): 32.86,46.54 32.86,40.19 32.89,40.16 39.32,40.16 39.32,46.54 39.34,46.56 32.94,46.56 32.91,46.54
  pour Top (no thermals): -1.32,58.86 20.89,58.86 20.89,57.96 21.55,57.3 42.47,57.3 43.13,57.96 43.13,73.7 45.14,75.71 90.71,75.71 90.71,0.88 87.51,-2.32 -0.2,-2.32 -1.32,-1.2
  cutout Top: 42.71,23.74 41.64,23.74 41.64,25.91 41.68,25.95 42.7,25.95 42.7,23.79 42.71,23.78 42.71,23.75
  cutout Top: 42.82,40.22 42.82,39.21 42.83,39.2 43.46,39.83 44.24,39.83 43.91,40.16 43.89,40.16 43.84,40.21 42.84,40.21
  pour Top (no thermals): 39.47,35.69 41.74,33.42 45.91,33.42 49.68,29.65 60.13,29.65 61.21,28.57 61.21,27.06 63.64,27.06 63.64,30.07 61.92,31.79 50.36,31.79 46.46,35.69
  pour Top (no thermals): 7.1,30.45 9.81,33.16 10.13,33.16 10.13,26.12 7.1,23.09
  cutout Top (no thermals): 13.97,52.72 13.97,52.3 13.96,52.29 14.34,52.29 14.35,52.28 14.35,52.7 14.33,52.72
  cutout Top (no thermals): 16.22,53.47 16.22,53.15 16.23,53.14 16.5,53.14 16.5,53.47 16.51,53.48 16.23,53.48
  cutout Top (no thermals): 29.44,55.46 29.44,54.99 29.03,54.99 29.03,55.46
  cutout Top (no thermals): 22.56,54.7 22.56,53.95 22.29,53.68 22.29,54.43
  cutout Top (no thermals): 34.12,50.73 34.12,50.11 34.75,50.11
  cutout Top (no thermals): 23.84,24.72 24.69,24.72 24.69,24.26 23.84,24.26
  cutout Top (no thermals): 25.68,23.44 25.68,22.91 25.17,22.91 25.17,23.44
  cutout Top (no thermals): 10.14,51.99 10.14,51.67 10.52,51.67 10.52,51.98 10.53,51.99 10.17,51.99 10.16,51.98
  cutout Top (no thermals): 34.61,56.22 34.61,55.78 34.62,55.77 34.25,55.77 34.25,56.2 34.61,56.2
  cutout Top (no thermals): 38.53,35.33 38.96,35.76 38.55,36.16 38.13,35.74
  cutout Top (no thermals): 38.52,29.82 38.83,29.82 38.83,29.55 38.52,29.55
  cutout Top (no thermals): 46.85,25.26 46.85,26.97 47.33,26.97 47.33,25.25 46.85,25.25 46.84,25.26
  cutout Top (no thermals): 39.51,35.61 39.77,35.87 39.34,36.3 39.09,36.05 39.5,35.65
  cutout Top (no thermals): 9.98,33.37 9.99,33.38 10.09,33.38 10.09,33.55 10.08,33.56 9.99,33.56 9.98,33.55
  cutout Top (no thermals): 7.04,23.37 7.05,23.36 7.05,23.26 7.22,23.26 7.23,23.27 7.23,23.36 7.22,23.37
  cutout Top: 45.25,45.55 45.25,46.7 45.26,46.71 46.63,46.71 46.63,48.24 44.54,48.24 44.54,47.1 44.53,47.09 43.22,47.09 43.22,45.55
  cutout Top: 39.19,27.88 39.83,27.88 39.83,27.32 39.19,27.32
  cutout Top: 39.85,23.47 39.2,23.47 39.2,23.75 39.89,23.75 39.9,23.74 39.9,23.46 39.91,23.46 39.91,23.45
  cutout Top: 57.79,53.96 58.08,53.96 58.08,53.62 57.81,53.62 57.8,53.63 57.8,53.95
  pour Bottom: -0.88,58.97 -1.45,58.4 -1.45,1.05 1.45,-1.85 87.27,-1.85 91.42,2.3 91.42,75.77 45.25,75.77 43.15,73.67 43.15,58.19 42.26,57.3 21.69,57.3 20.84,58.15 20.84,58.97
  cutout Top: 49.11,53.49 48.33,53.49 48.33,52.64 49.11,52.64
SWCLK-JTCK  (via drill 0.35)
  Top 0.152: ST_LINK.2 56.16,75.14 54.85,76.44 44.72,76.44 42.78,74.5 42.78,53.13 39.74,50.09 v39.74,49.92 | U$3.PA14 29.86,40.51 29.01,41.36 v29.01,46.67
  Bottom 0.152: v29.01,46.67 29.01,47.62 30.51,49.11 38.94,49.11 v39.74,49.92
SWDIO  (via drill 0.35)
  Top 0.152: ST_LINK.4 51.08,72.91 50.06,73.93 45.49,73.93 44.06,72.5 44.06,52.62 40.27,48.83 v40.27,48.55 | U$3.PA13 31.2,41.31 31.04,41.47 v31.04,46.04
  Bottom 0.152: v40.27,48.55 40.27,48 39.8,47.52 31.86,47.52 31.04,46.7 v31.04,46.04
TX
  Top 0.152: U$3.PB7 37.29,38.58 39.93,35.93 46.52,35.93 50.42,32.04 61.44,32.04 63.44,30.04 63.44,24.64 62.45,23.65 CN2.2 60.96,16.45 62.29,15.12 73.11,15.12 74.4,16.42 74.4,29.87 72.75,31.53 U1.TXD
V1  (via drill 0.4 pad 0.55)
  Top 0.5: U$12.VOUT R3.1 40,63.27 41.32,64.59 v41.32,65.21 | R2.1 40.36,69.62 41.35,68.63 v41.35,67.77
  Bottom 0.5: v41.32,65.21 v41.35,67.77
V2  (via drill 0.4 pad 0.55)
  Top 0.3: R5.1 33.87,69.6
  Top 0.5: U$13.VOUT R6.1 34.86,63.27 36.14,64.55 v36.14,65.18 | 33.87,69.6 35.12,69.6 36.12,68.61 v36.12,67.77
  Bottom 0.5: v36.14,65.18 v36.12,67.77
V3  (via drill 0.4 pad 0.55)
  Top 0.152: R9.1 28.8,63.3 | R8.1 28.8,69.65
  Top 0.5: U$14.VOUT R9.1 | 28.8,63.3 29.74,63.3 30.96,64.52 v30.96,65.18 | 28.8,69.65 29.9,69.65 30.96,68.58 v30.96,67.72
  Bottom 0.5: v30.96,65.18 v30.96,67.72
V4  (via drill 0.35)
  Top 0.5: U$15.VOUT R12.1 24.33,63.27 25.46,64.41 v25.46,65.04 | R11.1 24.55,69.64 25.46,68.73 v25.46,67.91
  Bottom 0.5: v25.46,65.04 v25.46,67.91